# Altium schematic sheet WaterLoveFlower.SchDoc
size A4; Author: zh; Revision: 0.1
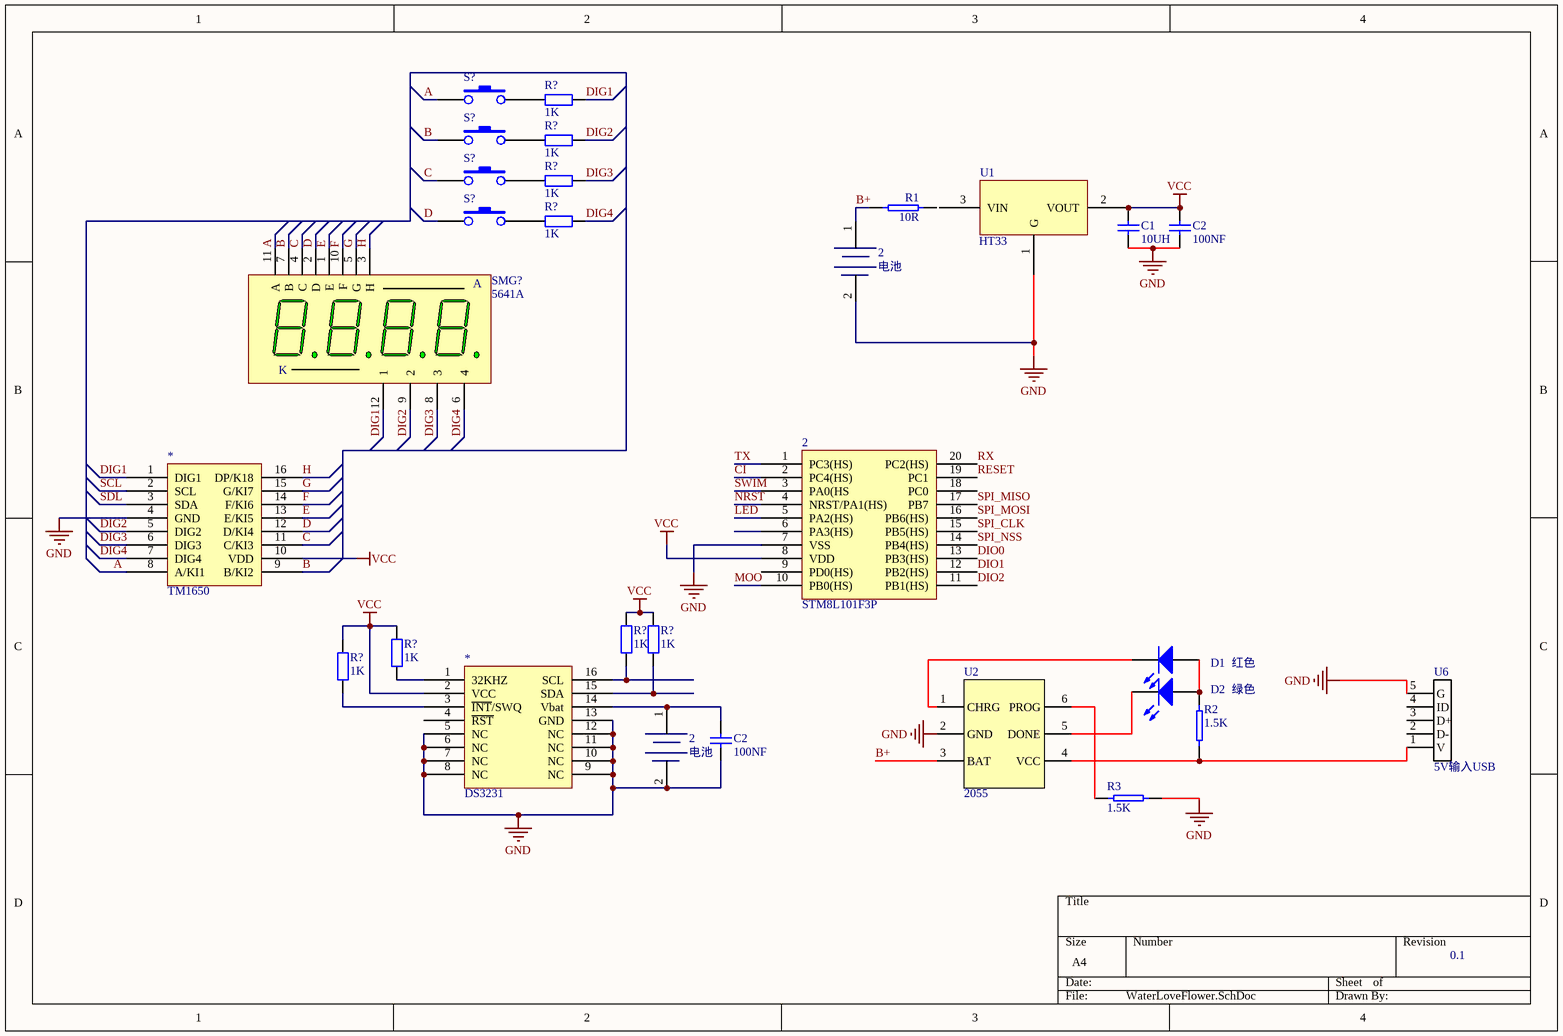
[diagram p0: WaterLoveFlower.SchDoc]

## Parts
(Parts that share a designator on the sheet are numbered #1, #2 ... from top to bottom, then left to right.)
2#1  电池
2#2  STM8L101F3P  [TSSOP20]
2#3  电池
*#1  TM1650  [SOP16]
*#2  DS3231  [SO-16]
C1  10UH
C2#1  100NF
C2#2  100NF
D1  红色  [led0805]
D2  绿色  [led0805]
R1  10R  [0805]
R2  1.5K  [0805]
R3  1.5K  [0805]
R?#1  1K  [R 0201_L]
R?#2  1K  [R 0201_L]
R?#3  1K  [R 0201_L]
R?#4  1K  [R 0201_L]
R?#5  1K  [R 0201_L]
R?#6  1K  [R 0201_L]
R?#7  1K  [R 0201_L]
R?#8  1K  [R 0201_L]
S?#1  微动开关  (value not drawn)
S?#2  微动开关  (value not drawn)
S?#3  微动开关  (value not drawn)
S?#4  微动开关  (value not drawn)
SMG?  5641A  [SMG 0.56-4P]
U1  HT33
U2  2055
U6  5V输入USB

## Nets
GND: 2#1.2(-) 2#2.7(VSS) 2#3.2(-) *#1.4(GND) *#2.5(NC) *#2.6(NC) *#2.7(NC) *#2.8(NC) *#2.9(NC) *#2.10(NC) *#2.11(NC) *#2.12(NC) *#2.13(GND) C1.1 C2#1.1 C2#2.1 R3.1 U1.1(G) U2.2(GND) U6.5(G)
VCC: 2#2.8(VDD) *#1.10(VDD) *#2.2(VCC) C1.2 C2#1.2 R?#5.2 R?#6.2 R?#7.2 R?#8.2 U1.2(VOUT)
A: *#1.8(A/KI1) S?#1.1 SMG?.11(A)
B: *#1.9(B/KI2) S?#2.1 SMG?.7(B)
B+: 2#1.1(+) R1.1 U2.3(BAT)
C: *#1.11(C/KI3) S?#3.1 SMG?.4(C)
CI: 2#2.2(PC4(HS))
D: *#1.12(D/KI4) S?#4.1 SMG?.2(D)
DIG1: *#1.1(DIG1) R?#1.2 SMG?.12(1)
DIG2: *#1.5(DIG2) R?#2.2 SMG?.9(2)
DIG3: *#1.6(DIG3) R?#3.2 SMG?.8(3)
DIG4: *#1.7(DIG4) R?#4.2 SMG?.6(4)
DIO0: 2#2.13(PB3(HS))
DIO1: 2#2.12(PB2(HS))
DIO2: 2#2.11(PB1(HS))
E: *#1.13(E/KI5) SMG?.1(E)
F: *#1.14(F/KI6) SMG?.10(F)
G: *#1.15(G/KI7) SMG?.5(G)
H: *#1.16(DP/K18) SMG?.3(H)
LED: 2#2.5(PA2(HS))
MOO: 2#2.10(PB0(HS))
NRST: 2#2.4(NRST/PA1(HS))
RESET: 2#2.19(PC1)
RX: 2#2.20(PC2(HS))
SCL: *#1.2(SCL)
SDL: *#1.3(SDA)
SPI_CLK: 2#2.15(PB5(HS))
SPI_MISO: 2#2.17(PB7)
SPI_MOSI: 2#2.16(PB6(HS))
SPI_NSS: 2#2.14(PB4(HS))
SWIM: 2#2.3(PA0(HS)
TX: 2#2.1(PC3(HS))
Net2#3_1: 2#3.1(+) *#2.14(Vbat) C2#2.2
Net*#2_1: *#2.1(32KHZ) R?#7.1
Net*#2_3: *#2.3(~{INT}/SWQ) R?#8.1
Net*#2_15: *#2.15(SDA) R?#6.1
Net*#2_16: *#2.16(SCL) R?#5.1
NetD1_1: D1.1 D2.1 R2.2
NetD1_2: D1.2 U2.1(CHRG)
NetD2_2: D2.2 U2.5(DONE)
NetR2_1: R2.1 U2.4(VCC) U6.1(V)
NetR3_2: R3.2 U2.6(PROG)
NetR?#1_1: R?#1.1 S?#1.2
NetR?#2_1: R?#2.1 S?#2.2
NetR?#3_1: R?#3.1 S?#3.2
NetR?#4_1: R?#4.1 S?#4.2

Not connected (* = marked no-connect by the designer): 2#2 6(PA3(HS)) 9(PD0(HS)) 18(PC0); *#2 4(~{RST}); R1 2; U1 3(VIN); U6 2(D-) 3(D+) 4(ID)

## Notes on the sheet
- (in symbol 5641A) K

## Library data of the parts
2#1 2#3 = BAT
C1 C2#1 C2#2 = CAP
D1 D2 = LED
R1 = RES: 电压设置
R2 R3 = RES
R?#1-R?#8 = R: 贴片电阻; 优秀评价可免费更新: 联系淘宝ID：黄晶宝石，获取更新版封装库; 卖家免费技术支持，联系售后: 唯一出售店铺网址https://shop463601444.taobao.com; 本封装库来自淘宝卖家 ID：黄晶宝石: 其他店铺购入均为盗版，请立即申请退款; BOM名称: 贴片电阻
SMG? = 5641A: 0.56寸4位共阴数码管; 版权归属: 封装库来自淘宝 ID：黄晶宝石; 优秀评价可免费更新: 联系淘宝ID：黄晶宝石，获取更新版封装库; 卖家免费技术支持，联系售后: 唯一出售店铺网址https://shop463601444.taobao.com; 封装库来自淘宝卖家 ID：黄晶宝石: 其他店铺购入均为盗版，请立即申请退款; BOM名称: 0.56寸4位共阴
U1 = 71XX
U2 = MCU-6